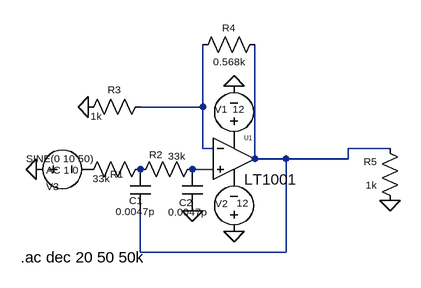
[diagram p0: schematic 7a1.AC LOW PASS.asc]
7a1.AC LOW PASS.asc, the LTspice schematic file:
Version 4
SHEET 1 880 680
WIRE 192 96 192 0
WIRE 192 96 96 96
WIRE 192 160 192 96
WIRE 208 160 192 160
WIRE 480 160 416 160
WIRE 272 176 272 0
WIRE 320 176 272 176
WIRE 416 176 416 160
WIRE 416 176 320 176
WIRE 208 192 176 192
WIRE 96 320 96 256
WIRE 320 320 320 176
WIRE 320 320 96 320
FLAG 176 256 0
FLAG -64 192 0
FLAG 16 96 0
FLAG 240 64 0
FLAG 240 288 0
FLAG 480 240 0
SYMBOL OpAmps\\LT1001 240 112 R0
WINDOW 0 16 32 Left 0
SYMATTR InstName U1
SYMBOL res 112 176 R90
WINDOW 0 34 52 VBottom 1
WINDOW 3 20 76 VTop 1
SYMATTR InstName R1
SYMATTR Value 33k
SYMBOL res 192 176 R90
WINDOW 0 4 72 VBottom 1
WINDOW 3 -15 40 VTop 1
SYMATTR InstName R2
SYMATTR Value 33k
SYMBOL res 112 80 R90
WINDOW 0 0 56 VBottom 1
WINDOW 3 20 84 VTop 1
SYMATTR InstName R3
SYMATTR Value 1k
SYMBOL res 288 -16 R90
WINDOW 0 0 56 VBottom 1
WINDOW 3 32 56 VTop 1
SYMATTR InstName R4
SYMATTR Value 0.568k
SYMBOL res 496 256 R180
WINDOW 0 36 76 Left 1
WINDOW 3 36 40 Left 1
SYMATTR InstName R5
SYMATTR Value 1k
SYMBOL cap 80 192 R0
WINDOW 0 -1 48 Left 1
WINDOW 3 -22 65 Left 1
SYMATTR InstName C1
SYMATTR Value 0.0047p
SYMBOL cap 160 192 R0
WINDOW 0 -4 51 Left 1
WINDOW 3 -21 66 Left 1
SYMATTR InstName C2
SYMATTR Value 0.0047p
SYMBOL voltage 240 160 R180
WINDOW 0 10 61 Left 1
WINDOW 3 -16 61 Left 1
SYMATTR InstName V1
SYMATTR Value 12
SYMBOL voltage 240 304 R180
WINDOW 0 9 59 Left 1
WINDOW 3 -22 60 Left 1
SYMATTR InstName V2
SYMATTR Value 12
SYMBOL voltage -80 192 R270
WINDOW 0 -37 41 VTop 1
WINDOW 3 27 51 VBottom 1
WINDOW 123 9 56 VBottom 1
WINDOW 39 0 0 Left 0
SYMATTR InstName V3
SYMATTR Value SINE(0 10 50)
SYMATTR Value2 AC 1 0
TEXT -88 328 Left 2 !.ac dec 20 50 50k

The netlist it stands for:
* 7a1.AC LOW PASS.asc
XU1 N003 N001 P001 P002 N002 LT1001  ; pins In+ In- V+ V- OUT
R1 P003 P004 33k
R2 N003 P003 33k
R3 N001 0 1k
R4 N002 N001 0.568k
R5 0 N002 1k
C1 P003 N002 0.0047p
C2 N003 0 0.0047p
V1 P001 0 12
V2 0 P002 12
V3 0 P004 SINE(0 10 50) AC 1 0
.ac dec 20 50 50k
.lib LTC.lib
.backanno
.end